# Altium schematic sheet BQ24295.SchDoc
size A4
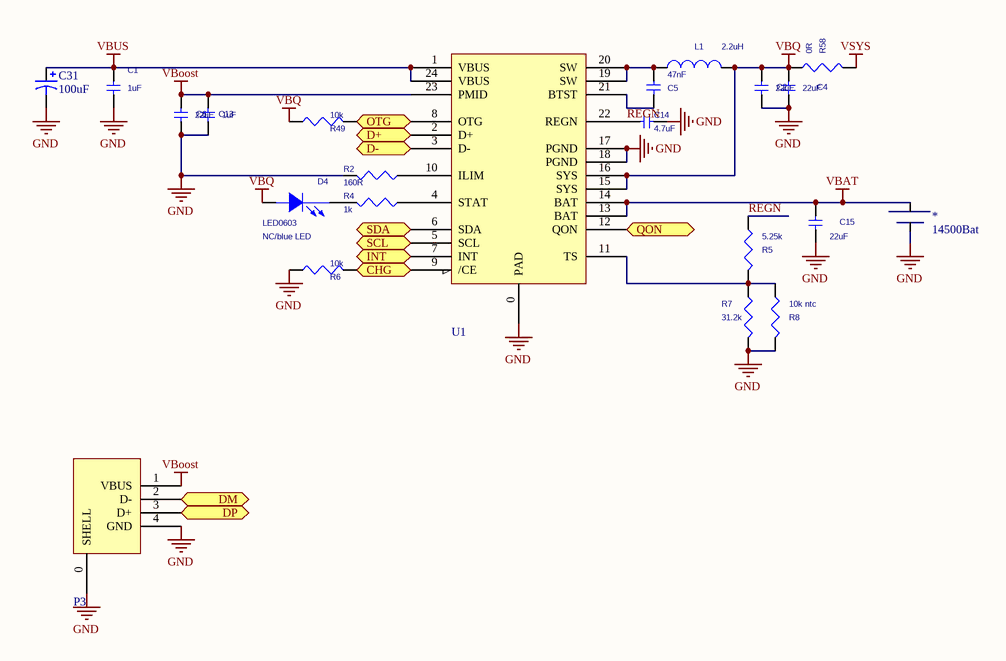
[diagram p0: BQ24295.SchDoc]

## Parts
*  14500Bat  [14500]
C1  1uF  [0805]
C2  22uF  [0805]
C4  22uF  [0805]
C5  47nF  [0402]
C6  22uF  [0805]
C13  1uF  [0603]
C14  4.7uF  [0603]
C15  22uF  [0805]
C31  100uF  [1210]
D4  value NC/blue LED  [LED0603]  (hidden comment: LED)
L1  2.2uH  [L50xx]
P3  USB_TYPE_A_SOCKET  [USB_TYPE_A_SOCKET]  (value not drawn)
R2  160R  [0402]
R4  1k  [0402]
R5  5.25k  [0402]
R6  10k  [0402]
R7  31.2k  [0402]
R8  10k ntc  [0603]
R49  10k  [0402]
R58  0R  [0402]
U1  BQ24295  [BQ24295]  (value not drawn)

## Ports
CHG, D+, D-, DM, DP, INT, OTG, QON, SCL, SDA

## Nets
GND: *.2 C1.2 C2.2 C4.2 C6.2 C13.2 C14.2 C15.2 C31.2 P3.0(SHELL) P3.4(GND) R2.2 R6.1 R7.2 R8.2 U1.0(PAD) U1.17(PGND) U1.18(PGND)
VBAT: *.1 C15.1 U1.13(BAT) U1.14(BAT)
VBoost: C6.1 C13.1 P3.1(VBUS) U1.23(PMID)
VBQ: C2.1 C4.1 D4.1(ANODE) L1.1 R49.1 R58.1 U1.15(SYS) U1.16(SYS)
VBUS: C1.1 C31.1 U1.1(VBUS) U1.24(VBUS)
VSYS: R58.2
CHG: R6.2 U1.9(/CE) ; port CHG
D+: U1.2(D+) ; port D+
D-: U1.3(D-) ; port D-
DM: P3.2(D-) ; port DM
DP: P3.3(D+) ; port DP
INT: U1.7(INT) ; port INT
OTG: R49.2 U1.8(OTG) ; port OTG
QON: U1.12(QON) ; port QON
REGN: C14.1 R5.1 U1.22(REGN)
SCL: U1.5(SCL) ; port SCL
SDA: U1.6(SDA) ; port SDA
NetC5_1: C5.1 U1.21(BTST)
NetC5_2: C5.2 L1.2 U1.19(SW) U1.20(SW)
NetD4_2: D4.2(CATHODE) R4.2
NetR2_1: R2.1 U1.10(ILIM)
NetR4_1: R4.1 U1.4(STAT)
NetR5_2: R5.2 R7.1 R8.1 U1.11(TS)

## Library data of the parts
C1 C5 C14 = C: PCB DECAL: C0402; Source_Path: C:\USERS\EULER-SJ\DESKTOP\CHEN-PI2\LIBRARY1.OLB; Value: 100nF/16V; PSpiceTemplate: C^@REFDES %1 %2 ?TOLERANCE|C^@REFDES| @VALUE ?IC/IC=@IC/ ?TOLERANCE|\n.model C^@REFDES CAP C=1 DEV=@TOLERANCE%|
C2 C4 C6 C13 C15 = C: PCB DECAL: C0805; Source_Path: C:\USERS\EULER-SJ\DESKTOP\CHEN-PI2\LIBRARY1.OLB; Value: 10uF/16V; PSpiceTemplate: C^@REFDES %1 %2 ?TOLERANCE|C^@REFDES| @VALUE ?IC/IC=@IC/ ?TOLERANCE|\n.model C^@REFDES CAP C=1 DEV=@TOLERANCE%|
C31 = Cap Pol1: Polarized Capacitor (Radial); Published: 8-Jun-2000; LatestRevisionDate: 17-Jul-2002; LatestRevisionNote: Re-released for DXP Platform.; PackageReference: RB7.6-15; Publisher: Altium Limited; PackageDescription: Polarized Capacitor (Radial); 2 Leads
D4 = LED: Source_Path: C:\PROGRAM FILES\ORCAD\CAPTURE\LIBRARY\DISCRETE.OLB; PCB DECAL: LED0603
L1 = INDUCTOR: PCB DECAL: LC7066CN; Source_Path: C:\PROGRAM FILES\ORCAD\CAPTURE\LIBRARY\DISCRETE.OLB; Value: 4.7uH
R2 R4-R8 R49 R58 = R: PCB DECAL: R0402; Source_Path: C:\USERS\EULER-SJ\DESKTOP\CHEN-PI2\LIBRARY1.OLB; Value: 12K